# EAGLE design timmy (EAGLE 8.2.0)
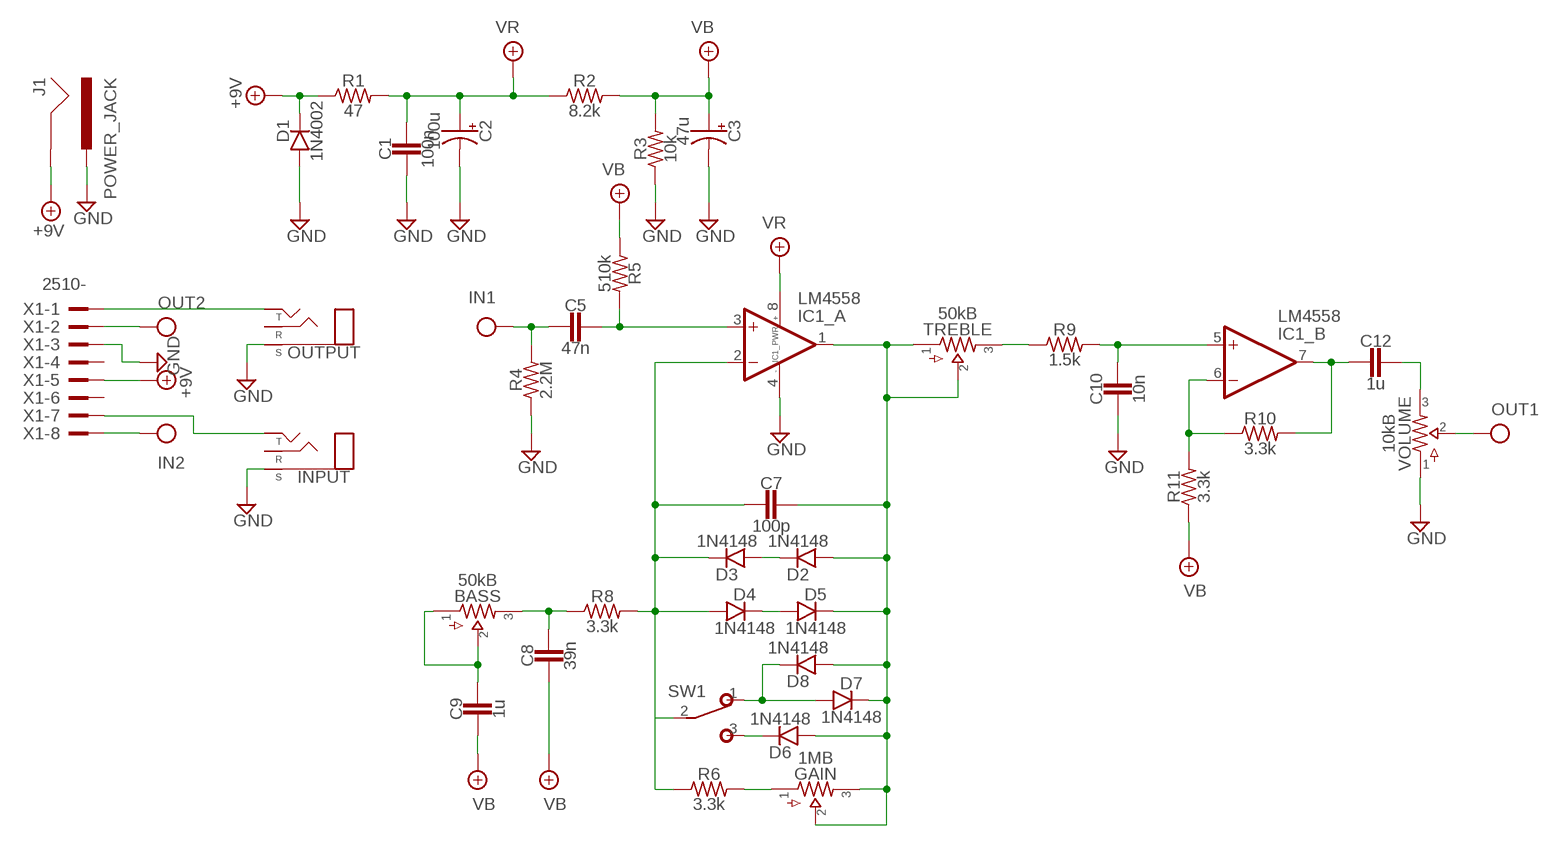
[diagram p0: schematic, sheet 1]

## Parts
BASS  50kB  POTS16MM  [16MM]
C1  100n  CER/FILM2  [050X030_025_2]
C2  100u  0500  [050_020]
C3  47u  0500  [050_020]
C5  47n  CER/FILMBOX.1  [BOX_SMALL]
C7  100p  CER/FILM2  [050X030_025_2]
C8  39n  CER/FILMBOX.1  [BOX_SMALL]
C9  1u  CER/FILMBOX.3  [BOX_BIG]
C10  10n  CER/FILMBOX.1  [BOX_SMALL]
C12  1u  CER/FILMBOX.3  [BOX_BIG]
D1  1N4002  DO41.2  [DO41-2]
D2  1N4148  DO35.2  [DO35-2]
D3  1N4148  DO35.2  [DO35-2]
D4  1N4148  DO35.2  [DO35-2]
D5  1N4148  DO35.2  [DO35-2]
D6  1N4148  DO35.2  [DO35-2]
D7  1N4148  DO35.2  [DO35-2]
D8  1N4148  DO35.2  [DO35-2]
GAIN  1MB  POTS16MM  [16MM]
IC1  LM4558  DUALTH  [DIL08]
INPUT  STEREONMJ  [NMJ6HCD2]
J1  POWER_JACK  [POWER_JACK_PTH]
OUTPUT  STEREONMJ  [NMJ6HCD2]
R1  47  R_.3B  [R0207/3]
R2  8.2k  R_.3B  [R0207/3]
R3  10k  R_.3B  [R0207/3]
R4  2.2M  R_.3B  [R0207/3]
R5  510k  R_.3B  [R0207/3]
R6  3.3k  R_.3B  [R0207/3]
R8  3.3k  R_.3B  [R0207/3]
R9  1.5k  R_.3B  [R0207/3]
R10  3.3k  R_.3B  [R0207/3]
R11  3.3k  R_.3B  [R0207/3]
SW1  SPDT  [M9040P]
TREBLE  50kB  POTS16MM  [16MM]
VOLUME  10kB  POTS16MM  [16MM]
X1  2510-  [PAK100/2500-10]

## Nets
+9V: D1.C J1.GND R1.1 X1.5
GND: C1.2 C2.- C3.- C10.2 D1.A IC1.4(_PWR:V-) INPUT.S J1.PWR OUTPUT.S R3.1 R4.1 VOLUME.1 X1.3
IN: C5.2 R4.2 X1.8
N$1: D6.C SW1.3(S)
N$2: INPUT.T X1.7
N$3: C5.1 IC1.3(_A:+IN) R5.2
N$4: OUTPUT.T X1.1
N$5: C7.2 D3.C D4.A IC1.2(_A:-IN) R6.1 R8.2 SW1.2(P)
N$6: C7.1 D2.A D5.C D6.A D7.C D8.A GAIN.2 GAIN.3 IC1.1(_A:OUT) TREBLE.1 TREBLE.2
N$7: GAIN.1 R6.2
N$8: D2.C D3.A
N$9: D4.C D5.A
N$10: D7.A D8.C SW1.1(O)
N$11: BASS.3 C8.1 R8.1
N$12: R9.1 TREBLE.3
N$13: BASS.1 BASS.2 C9.1
N$14: C10.1 IC1.5(_B:+IN) R9.2
N$15: IC1.6(_B:-IN) R10.1 R11.2
N$16: C12.2 IC1.7(_B:OUT) R10.2
N$17: C12.1 VOLUME.3
OUT: VOLUME.2 X1.2
VB: C3.+ C8.2 C9.2 R2.2 R3.2 R5.1 R11.1
VR: C1.1 C2.+ IC1.8(_PWR:V+) R1.2 R2.1
Unconnected: INPUT.R OUTPUT.R X1.4 X1.6

## Library data of the parts
BASS GAIN TREBLE VOLUME = pedals-potentiometers:POTS
C1 C5 C7-C10 C12 = pedals-capacitors-film:CER/FILM: 47 - 120pF Xicon Ceramic Disc 2.5mm lead spacing
C2 C3 = pedals-capacitors-elec:050
D1 = pedals-diodes:DO41: DO-41 Package Diodes: 1N4001 - 1N40019 Zener Diodes: 1N4728 - 1N4764
D2-D8 = pedals-diodes:DO35: DO-35 Package Diodes: 1N914
IC1 = pedals-integrated circuits:DUAL: OP AMP
INPUT OUTPUT = pedals-jacks:STEREO
J1 = pedals-jacks:POWER_JACK: Power Jack Connector This is the standard 5.5mm barrel jack for power. The PTH is the most common, proven, reliable, footprint. The Slot footprint only works if the mill layer is transmitted to the PCB fab house so be warned. Here are the connectors we sell at SparkFun: DC Barrel Power Jack/Connector <https://www.sparkfun.com/products/119> (PRT-00119) DC Barrel Power Jack/Connector (SMD) <https://www.sparkfun.com/products/12748> (PRT-12748) DC Barrel Jack Adapter - Breadboard Compatible <https://www.sparkfun.com/products/10811> (PRT-10811) It is used on this SparkFun product (and many, many others): SparkFun RedBoard - Programmed with Arduino <https://www.sparkfun.com/products/12757> (DEV-12757) Also, if you need a mating power supply or connector, please check these out: Wall Adapter Power Supply - 9VDC 650mA <https://www.sparkfun.com/products/298> (TOL-00298) DC Barrel Jack Adapter - Male <https://www.sparkfun.com/products/10287> (PRT-10287); PROD_ID: CONN-08197
R1-R6 R8-R11 = pedals-resistors:R_
SW1 = pedals-switches:SPDT: TOGGLE SWITCH Marquardt
X1 = pedals-headers:2510-: 3M (TM) Pak 100 4-Wall Header Source: 3M; MF: 3M; MPN: 2510-6002UB; OC_FARNELL: 9838244; OC_NEWARK: 46F4725

## Board
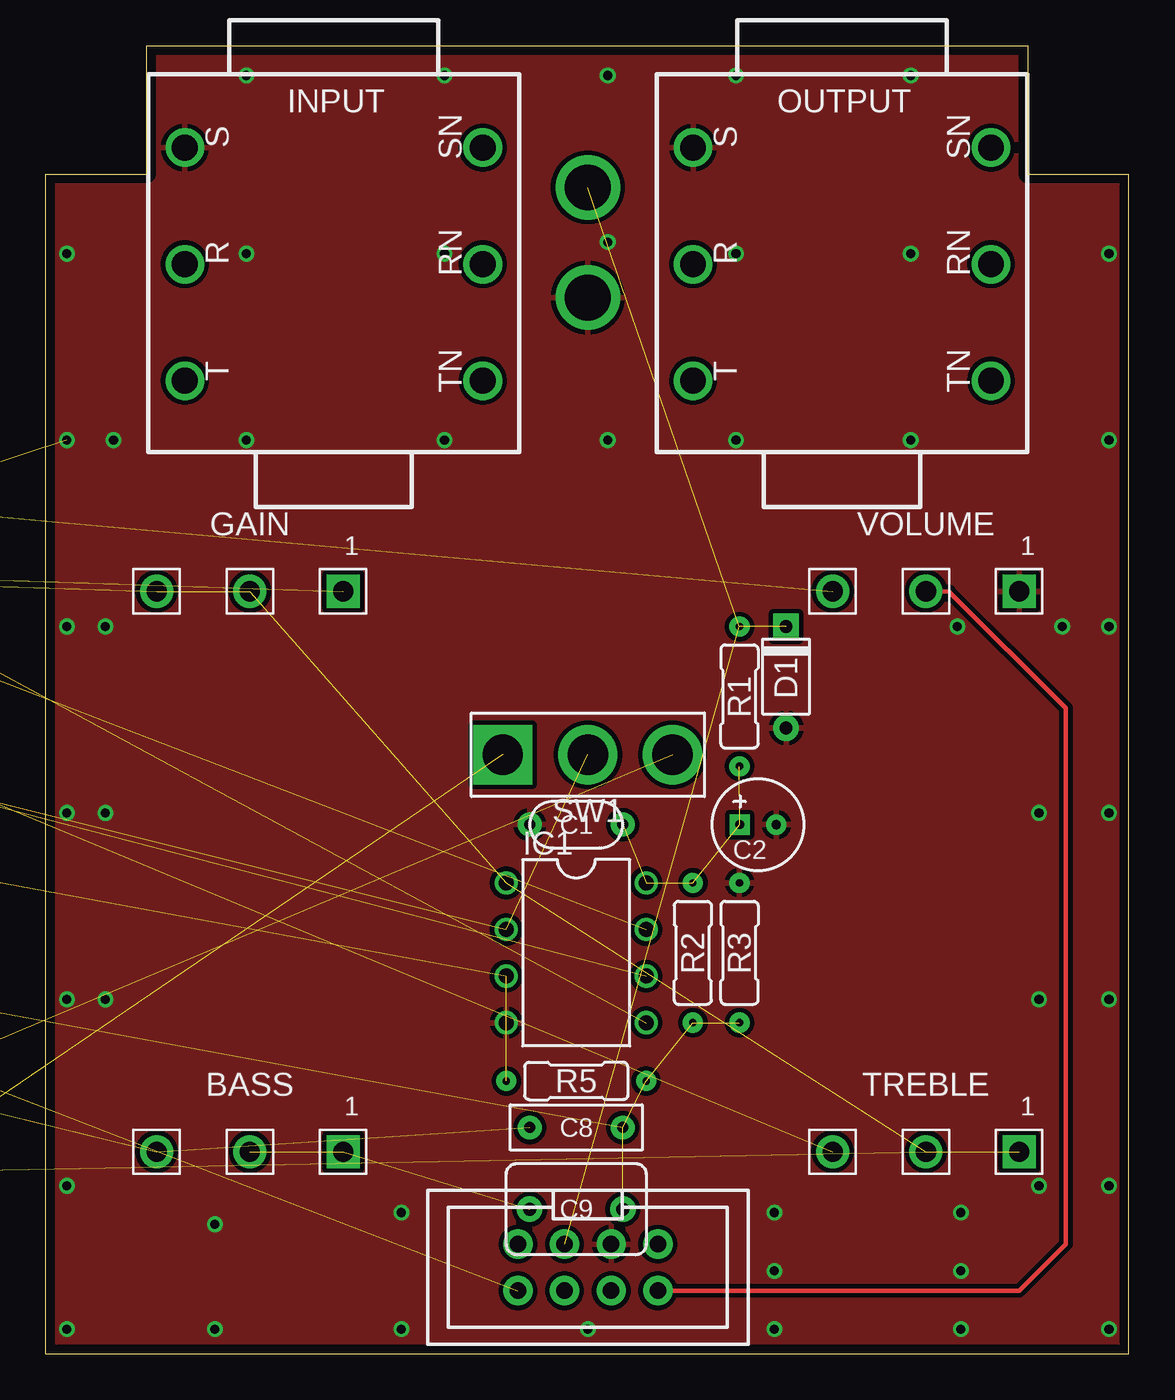
[diagram p1: board, top side]
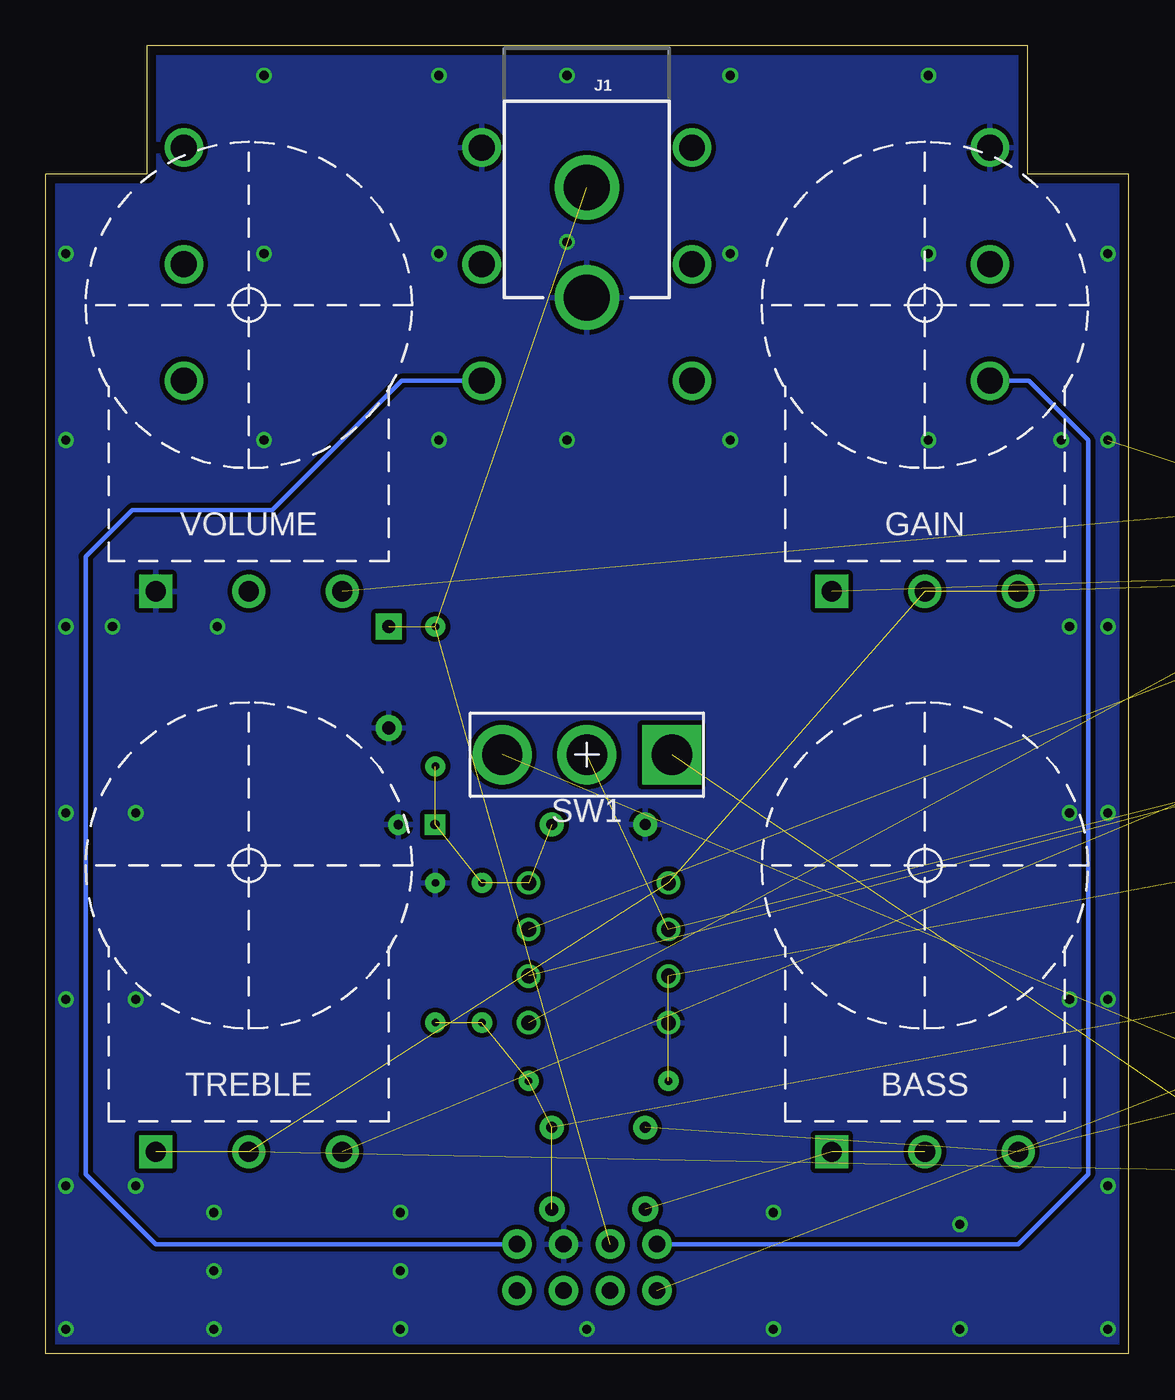
[diagram p2: board, bottom side, seen from below]

Size 59 x 71.27 mm. Coordinates in mm from the lower left corner, seen from the top.
Copper layers (1*16): Top 0.035mm / dielectric 1.6mm / Bottom 0.035mm
Design rules "Elecrow_2-layer_PCB_eagle_rule": minimum track width 6mil, minimum drill 12mil, track to track 6mil, track to pad 6mil, pad to pad 6mil, via to via 8mil, smd to smd 0mil, copper to edge 20mil, drill to drill 10mil, minimum pad ring 6mil, minimum via ring 6mil, stop-mask expansion 0mil, vias tented up to drill 100mil, thermal gap 10mil
tRestrict: 1 lines

### Footprints (pad centres in the part's own frame; a part is rotated, then mirrored left to right if it is on the bottom)
16MM = drill 1.1 pad 1.8 square: 1 5.08,-1 | drill 1.1 pad 1.8: 2 0,-1; 3 -5.08,-1
050X030_025_2 = drill 0.6 pad 1.3: 1 -2.54,0; 2 2.54,0
050_020 = drill 0.5 pad 1.1 square: + -0.998,0.001 | drill 0.5 pad 1.1: - 0.998,0.001
BOX_SMALL = drill 0.6 pad 1.3: 1 -2.54,0; 2 2.54,0
BOX_BIG = drill 0.7 pad 1.4: 1 -2.54,0; 2 2.54,0
DO41-2 = drill 0.7 pad 1.4: A 2.794,0 | drill 0.7 pad 1.4 square: C -2.731,0
DO35-2 = drill 0.5 pad 1.2: A 2.54,0 | drill 0.5 pad 1.2 square: C -2.54,0
DIL08 = drill 0.813 pad 1.27: 1 -3.81,-3.81; 2 -1.27,-3.81; 3 1.27,-3.81; 4 3.81,-3.81; 5 3.81,3.81; 6 1.27,3.81; 7 -1.27,3.81; 8 -3.81,3.81
NMJ6HCD2 = drill 1.4: R 0,8.115; RN 0,-8.115; S 6.35,8.115; SN 6.35,-8.115; T -6.35,8.115; TN -6.35,-8.115
POWER_JACK_PTH = drill 2.5: GND 0,7.7; PWR 0,13.7
R0207/3 = drill 0.4 pad 1.1: 1 -3.81,0; 2 3.81,0
M9040P = drill 2.2 pad 2.9 square: 1 4.636,0 | drill 2.2 pad 2.9: 2 0,0; 3 -4.61,0
PAK100/2500-10 = drill 0.9 pad 1.6: 1 -3.81,-1.27; 2 -3.81,1.27; 3 -1.27,-1.27; 4 -1.27,1.27; 5 1.27,-1.27; 6 1.27,1.27; 7 3.81,-1.27; 8 3.81,1.27

### Placement (x,y rotation side)
BASS  11.11,12 0 top
C1  28.89,28.83 180 top
C2  38.8,28.83 0 top
C3  -19.64,27.56 0 top  (outside the outline)
C5  -33.34,28.83 270 top  (outside the outline)
C7  -33.34,40.26 270 top  (outside the outline)
C8  28.89,12.32 0 top
C9  28.89,7.87 0 top
C10  -8.57,44.07 90 top  (outside the outline)
C12  -13.65,44.07 270 top  (outside the outline)
D1  40.32,36.89 270 top
D2  -43.5,40.26 90 top  (outside the outline)
D3  -46.04,40.26 90 top  (outside the outline)
D4  -35.88,40.26 270 top  (outside the outline)
D5  -38.42,40.26 90 top  (outside the outline)
D6  -17.46,9.78 0 top  (outside the outline)
D7  -18.73,4.7 0 top  (outside the outline)
D8  -26.35,-0.38 0 top  (outside the outline)
GAIN  11.11,42.55 0 top
IC1  28.89,21.84 270 top
INPUT  15.68,59.37 90 top
J1  29.53,71.25 180 bottom
OUTPUT  43.37,59.37 90 top
R1  37.78,35.81 270 top
R2  35.24,21.84 270 top
R3  37.78,21.84 270 top
R4  -35.88,27.56 270 top  (outside the outline)
R5  28.89,14.86 180 top
R6  -40.96,39.62 90 top  (outside the outline)
R8  -46.04,27.56 90 top  (outside the outline)
R9  -6.03,35.18 90 top  (outside the outline)
R10  -8.57,35.18 90 top  (outside the outline)
R11  -9.84,23.75 90 top  (outside the outline)
SW1  29.53,32.64 180 top
TREBLE  47.94,12 0 top
U$1  [125B_PCB]  0,1.27 0 top
VOLUME  47.94,42.55 0 top
X1  29.53,4.7 180 top

### Tracks (layer width: path | path; a pad name or v marks a point on that pad's centre or on a via)
+9V  (3 unrouted)
GND  (via drill 0.5 pad 0.85)  (4 unrouted)
  other vias: 57.91,59.94 57.91,49.78 10.92,69.66 21.72,69.66 30.61,69.66 1.14,49.78 10.92,59.94 10.92,49.78 21.72,49.78 30.61,60.58 30.61,49.78 37.59,69.66 47.12,69.66 37.59,59.94 37.59,49.78 47.12,59.94 47.12,49.78 57.91,39.62 57.91,29.46 57.91,19.3 57.91,9.14 57.91,1.33 49.85,1.33 39.69,1.33 29.53,1.33 19.37,1.33 9.21,1.33 1.14,1.33 1.14,59.94 1.14,39.62 1.14,29.46 1.14,19.3 1.14,9.14 39.69,4.51 49.85,4.51 39.69,7.68 49.85,7.68 19.37,7.68 9.21,7.05 54.1,9.14 54.1,19.3 54.1,29.46 49.66,39.62 3.68,49.78 3.24,39.62 3.24,29.46 3.24,19.3 21.72,59.94 -13.65,43.43 55.37,39.62
  pour Top (isolate 0.254): 0.32,70.74 58.74,70.74 58.74,-1.02 0.32,-1.02
  pour Bottom (isolate 0.254): 0.32,-0.38 59.37,-0.38 59.37,72.01 -0.32,72.01 -0.32,-0.38
IN  (2 unrouted)
N$1  (1 unrouted)
N$2
  Bottom 0.254: X1.7 6.03,5.97 2.22,9.78 2.22,49.78 5.46,53.02 INPUT.T
N$3  (2 unrouted)
N$4
  Bottom 0.254: X1.1 53.02,5.97 56.83,9.78 56.83,43.43 54.29,45.97 46.67,45.97 39.62,53.02 OUTPUT.T
N$5  (6 unrouted)
N$6  (10 unrouted)
N$7  (1 unrouted)
N$8  (1 unrouted)
N$9  (1 unrouted)
N$10  (2 unrouted)
N$11  (2 unrouted)
N$12  (1 unrouted)
N$13  (2 unrouted)
N$14  (2 unrouted)
N$15  (2 unrouted)
N$16  (2 unrouted)
N$17  (1 unrouted)
OUT
  Top 0.254: VOLUME.2 49.2,41.55 55.56,35.18 55.56,5.97 53.02,3.43 X1.2
VB  (6 unrouted)
VR  (4 unrouted)